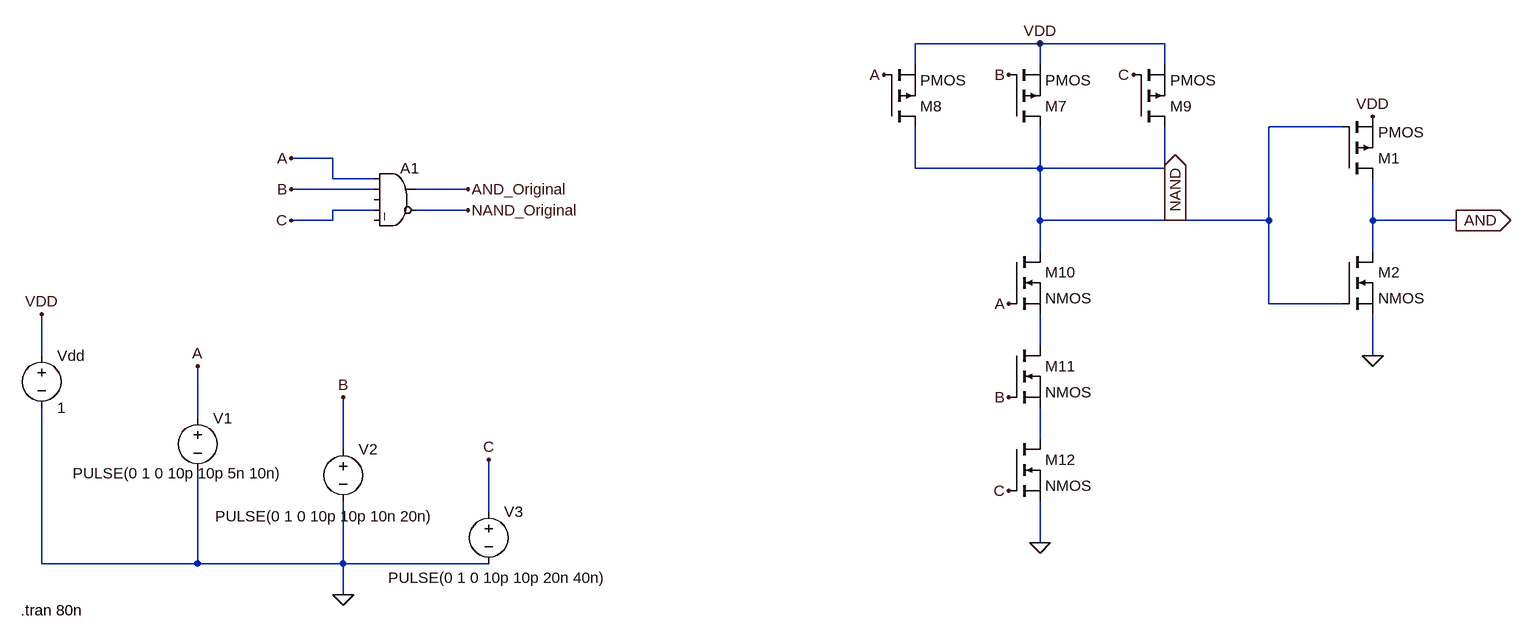
[diagram p0: schematic NAND_3ip_&_AND_3ip.asc]
NAND_3ip_&_AND_3ip.asc, the LTspice schematic file:
Version 4
SHEET 1 3108 680
WIRE 1680 -368 1488 -368
WIRE 1872 -368 1680 -368
WIRE 1488 -336 1488 -368
WIRE 1680 -336 1680 -368
WIRE 1872 -336 1872 -368
WIRE 2144 -240 2032 -240
WIRE 592 -192 528 -192
WIRE 1488 -176 1488 -240
WIRE 1680 -176 1680 -240
WIRE 1680 -176 1488 -176
WIRE 1872 -176 1872 -240
WIRE 1872 -176 1680 -176
WIRE 592 -160 592 -192
WIRE 656 -160 592 -160
WIRE 656 -144 528 -144
WIRE 800 -144 720 -144
WIRE 656 -112 592 -112
WIRE 800 -112 720 -112
WIRE 592 -96 592 -112
WIRE 592 -96 528 -96
WIRE 1680 -96 1680 -176
WIRE 1888 -96 1680 -96
WIRE 2032 -96 2032 -240
WIRE 2032 -96 1888 -96
WIRE 2192 -96 2192 -160
WIRE 2320 -96 2192 -96
WIRE 1680 -48 1680 -96
WIRE 2192 -48 2192 -96
WIRE 2032 32 2032 -96
WIRE 2144 32 2032 32
WIRE 1680 96 1680 48
WIRE 144 112 144 48
WIRE 2192 112 2192 48
WIRE 384 208 384 128
WIRE 1680 240 1680 192
WIRE 608 256 608 176
WIRE 832 352 832 272
WIRE 1680 400 1680 336
WIRE 144 432 144 192
WIRE 384 432 384 288
WIRE 384 432 144 432
WIRE 608 432 608 336
WIRE 608 432 384 432
WIRE 832 432 608 432
WIRE 608 480 608 432
FLAG 608 480 0
FLAG 384 128 A
FLAG 144 48 VDD
FLAG 608 176 B
FLAG 800 -144 AND_Original
FLAG 800 -112 NAND_Original
FLAG 832 272 C
FLAG 528 -192 A
FLAG 528 -144 B
FLAG 528 -96 C
FLAG 1680 -368 VDD
FLAG 1680 400 0
FLAG 1440 -320 A
FLAG 1632 -320 B
FLAG 1824 -320 C
FLAG 1632 32 A
FLAG 1632 176 B
FLAG 1632 320 C
FLAG 2192 -256 VDD
FLAG 2192 112 0
FLAG 1888 -96 NAND
IOPIN 1888 -96 Out
FLAG 2320 -96 AND
IOPIN 2320 -96 Out
SYMBOL voltage 144 96 R0
WINDOW 123 0 0 Left 0
WINDOW 39 0 0 Left 0
SYMATTR InstName Vdd
SYMATTR Value 1
SYMBOL voltage 384 192 R0
WINDOW 123 0 0 Left 0
WINDOW 39 0 0 Left 0
WINDOW 3 -192 101 Left 2
SYMATTR Value PULSE(0 1 0 10p 10p 5n 10n)
SYMATTR InstName V1
SYMBOL voltage 608 240 R0
WINDOW 123 0 0 Left 0
WINDOW 39 0 0 Left 0
WINDOW 3 -197 119 Left 2
SYMATTR Value PULSE(0 1 0 10p 10p 10n 20n)
SYMATTR InstName V2
SYMBOL Digital\\and 688 -192 R0
SYMATTR InstName A1
SYMBOL voltage 832 336 R0
WINDOW 123 0 0 Left 0
WINDOW 39 0 0 Left 0
WINDOW 3 -155 118 Left 2
SYMATTR Value PULSE(0 1 0 10p 10p 20n 40n)
SYMATTR InstName V3
SYMBOL pmos 1824 -240 M180
SYMATTR InstName M9
SYMBOL pmos 1632 -240 M180
SYMATTR InstName M7
SYMBOL pmos 1440 -240 M180
SYMATTR InstName M8
SYMBOL nmos 1632 -48 R0
SYMATTR InstName M10
SYMBOL nmos 1632 96 R0
SYMATTR InstName M11
SYMBOL nmos 1632 240 R0
SYMATTR InstName M12
SYMBOL pmos 2144 -160 M180
SYMATTR InstName M1
SYMBOL nmos 2144 -48 R0
SYMATTR InstName M2
TEXT 112 504 Left 2 !.tran 80n

The netlist it stands for:
* NAND_3ip_&_AND_3ip.asc
Vdd VDD 0 1
V1 A 0 PULSE(0 1 0 10p 10p 5n 10n)
V2 B 0 PULSE(0 1 0 10p 10p 10n 20n)
A1 A B 0 C 0 NAND_Original AND_Original 0 AND
V3 C 0 PULSE(0 1 0 10p 10p 20n 40n)
M9 NAND C VDD VDD PMOS
M7 NAND B VDD VDD PMOS
M8 NAND A VDD VDD PMOS
M10 NAND A N001 N001 NMOS
M11 N001 B N002 N002 NMOS
M12 N002 C 0 0 NMOS
M1 AND NAND VDD VDD PMOS
M2 AND NAND 0 0 NMOS
.model NMOS NMOS
.model PMOS PMOS
.lib standard.mos
.tran 80n
.backanno
.end